# Altium schematic sheet connectors.SchDoc
size 431 x 279 mm; SheetNumber: 2; SheetTotal: 4
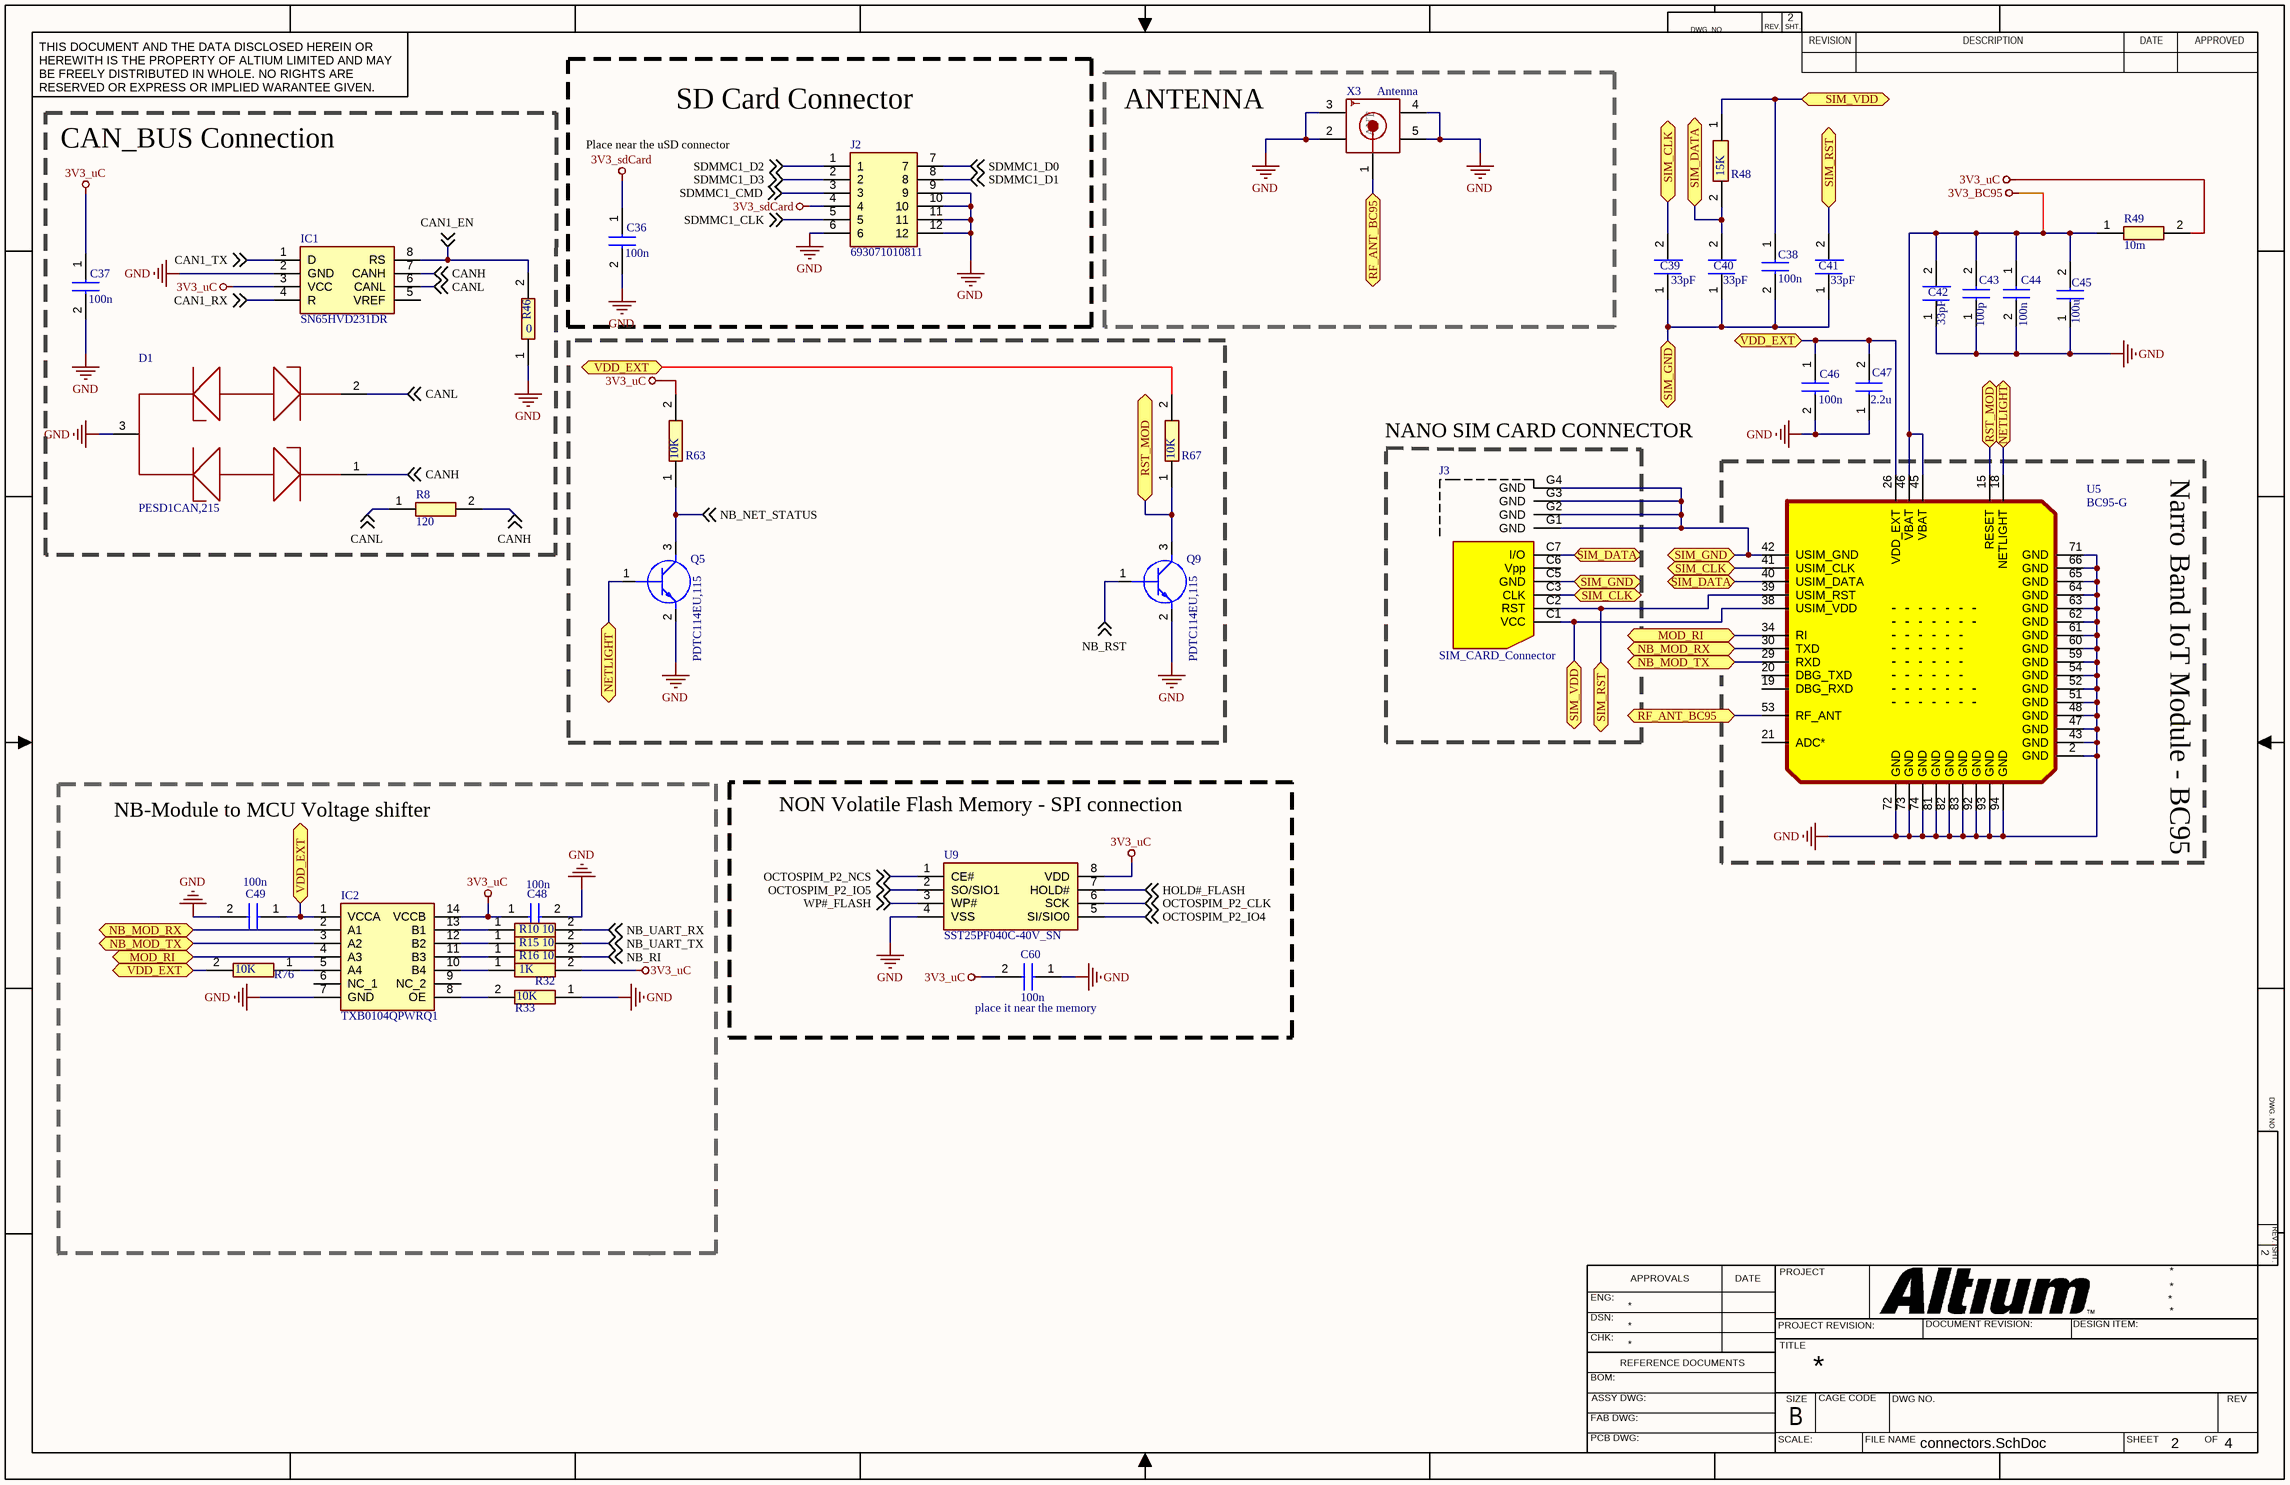
[diagram p0: connectors.SchDoc]

## Parts
C36  100n  [CAPC1608X87N]
C37  100n  [CAPC1608X87N]
C38  100n  [CAPC1608X87N]
C39  33pF  [CAPC1608X87N]
C40  33pF  [CAPC1608X87N]
C41  33pF  [CAPC1608X87N]
C42  33pF  [CAPC1608X87N]
C43  100p  [CAPC1608X87N]
C44  100n  [CAPC1608X87N]
C45  100u  [CAPC3216X180N]
C46  100n  [CAPC1608X87N]
C47  2.2u  [CAPC1608X50N]
C48  100n  [CAPC1608X87N]
C49  100n  [CAPC1608X87N]
C60  100n  [CAPC1608X87N]
D1  PESD1CAN,215  [SOT95P230X110-3N]
IC1  SN65HVD231DR  [SOIC127P600X175-8N]
IC2  TXB0104QPWRQ1  [SOP65P640X120-14N]
J2  693071010811  [693071010811]
J3  SIM_CARD_Connector  [SIM8060601400A]
Q5  PDTC114EU,115  [SOT65P210X110-3N]
Q9  PDTC114EU,115  [SOT65P210X110-3N]
R8  120  [ERA2V_(0402)]
R10  10  [RESC1005X40N]
R15  10  [RESC1005X40N]
R16  10  [RESC1005X40N]
R32  1K  [RESC1608X55N]
R33  10K  [ERJ3EK_(0603)]
R46  0  [RESC1608X55N]
R48  15K  [RESC1508X50N]
R49  10m  [ERJ6_B_BW_R_LW_CW_D]
R63  10K  [ERJ3EK_(0603)]
R67  10K  [ERJ3EK_(0603)]
R76  10K  [ERJ3EK_(0603)]
U5  BC95-G  [XCVR_BC95GJB02STD]
U9  SST25PF040C-40V_SN  [SOIC127P600X175-8N]
X3  Antenna  [PCBSMAFRAHT]

## Blocks framed on the sheet
CAN_BUS Connection: C37 D1 IC1 R8 R46
SD Card Connector: C36 J2
ANTENNA: X3
NB-Module to MCU Voltage shifter: C48 C49 IC2 R10 R15 R16 R32 R33 R76
NON Volatile Flash Memory - SPI connection: C60 U9

## Ports
MOD_RI (bidir), NB_MOD_RX (bidir), NB_MOD_TX (bidir), NETLIGHT (bidir), RF_ANT_BC95 (bidir), RST_MOD (bidir), SIM_CLK (bidir), SIM_DATA (bidir), SIM_GND (bidir), SIM_RST (bidir), SIM_VDD (bidir), VDD_EXT (bidir)

## Nets
3V3_BC95: C42.2 C43.2 C44.1 C45.2 R49.1 U5.45(VBAT) U5.46(VBAT)
3V3_sdCard: C36.1 J2.4
3V3_uC: C37.1 C48.1 C60.2 IC1.3(VCC) IC2.14(VCCB) R32.2 R49.2 R63.2 U9.8(VDD)
GND: C36.2 C37.2 C42.1 C43.1 C44.2 C45.1 C46.2 C47.1 C48.2 C49.2 C60.1 D1.3 IC1.2(GND) IC2.7(GND) J2.6 J2.9 J2.10 J2.11 J2.12 Q5.2(E) Q9.2(E) R33.1 R46.1 U5.2(GND) U5.43(GND) U5.47(GND) U5.48(GND) U5.51(GND) U5.52(GND) U5.54(GND) U5.59(GND) U5.60(GND) U5.61(GND) U5.62(GND) U5.63(GND) U5.64(GND) U5.65(GND) U5.66(GND) U5.71(GND) U5.72(GND) U5.73(GND) U5.74(GND) U5.81(GND) U5.82(GND) U5.83(GND) U5.92(GND) U5.93(GND) U5.94(GND) U9.4(VSS) X3.2 X3.3 X3.4 X3.5
CAN1_EN: IC1.8(RS) R46.2 ; off-sheet CAN1_EN
CAN1_RX: IC1.4(R) ; off-sheet CAN1_RX
CAN1_TX: IC1.1(D) ; off-sheet CAN1_TX
CANH: D1.1 IC1.7(CANH) R8.2 ; off-sheet CANH
CANL: D1.2 IC1.6(CANL) R8.1 ; off-sheet CANL
HOLD#_FLASH: U9.7(HOLD#) ; off-sheet HOLD#_FLASH
MOD_RI: IC2.4(A3) U5.34(RI) ; port MOD_RI
NB_MOD_RX: IC2.2(A1) U5.30(TXD) ; port NB_MOD_RX
NB_MOD_TX: IC2.3(A2) U5.29(RXD) ; port NB_MOD_TX
NB_NET_STATUS: Q5.3(C) R63.1 ; off-sheet NB_NET_STATUS
NB_RI: R16.2 ; off-sheet NB_RI
NB_RST: Q9.1(B) ; off-sheet NB_RST
NB_UART_RX: R10.2 ; off-sheet NB_UART_RX
NB_UART_TX: R15.2 ; off-sheet NB_UART_TX
NETLIGHT: Q5.1(B) U5.18(NETLIGHT) ; port NETLIGHT
OCTOSPIM_P2_CLK: U9.6(SCK) ; off-sheet OCTOSPIM_P2_CLK
OCTOSPIM_P2_IO4: U9.5(SI/SIO0) ; off-sheet OCTOSPIM_P2_IO4
OCTOSPIM_P2_IO5: U9.2(SO/SIO1) ; off-sheet OCTOSPIM_P2_IO5
OCTOSPIM_P2_NCS: U9.1(CE#) ; off-sheet OCTOSPIM_P2_NCS
RF_ANT_BC95: U5.53(RF_ANT) X3.1 ; port RF_ANT_BC95
RST_MOD: Q9.3(C) R67.1 U5.15(RESET) ; port RST_MOD
SDMMC1_CLK: J2.5 ; off-sheet SDMMC1_CLK
SDMMC1_CMD: J2.3 ; off-sheet SDMMC1_CMD
SDMMC1_D0: J2.7 ; off-sheet SDMMC1_D0
SDMMC1_D1: J2.8 ; off-sheet SDMMC1_D1
SDMMC1_D2: J2.1 ; off-sheet SDMMC1_D2
SDMMC1_D3: J2.2 ; off-sheet SDMMC1_D3
SIM_CLK: C39.2 J3.C3(CLK) U5.41(USIM_CLK) ; port SIM_CLK
SIM_DATA: C40.2 J3.C7(I/O) R48.2 U5.40(USIM_DATA) ; port SIM_DATA
SIM_GND: C38.2 C39.1 C40.1 C41.1 J3.C5(GND) J3.G1(GND) J3.G2(GND) J3.G3(GND) J3.G4(GND) U5.42(USIM_GND) ; port SIM_GND
SIM_RST: C41.2 J3.C2(RST) U5.39(USIM_RST) ; port SIM_RST
SIM_VDD: C38.1 J3.C1(VCC) R48.1 U5.38(USIM_VDD) ; port SIM_VDD
VDD_EXT: C46.1 C47.2 C49.1 IC2.1(VCCA) R67.2 R76.2 U5.26(VDD_EXT) ; port VDD_EXT
WP#_FLASH: U9.3(WP#) ; off-sheet WP#_FLASH
NetIC2_5: IC2.5(A4) R76.1
NetIC2_8: IC2.8(OE) R33.2
NetIC2_10: IC2.10(B4) R32.1
NetIC2_11: IC2.11(B3) R16.1
NetIC2_12: IC2.12(B2) R15.1
NetIC2_13: IC2.13(B1) R10.1

Not connected (* = marked no-connect by the designer): IC1 5(VREF); IC2 6(NC_1) 9(NC_2); J3 C6(Vpp); U5 1(RESERVED) 3(RESERVED) 4(RESERVED) 5(RESERVED) 6(RESERVED) 7(RESERVED) 8(RESERVED) 9(RESERVED) 10(RESERVED) 11(RESERVED) 12(RESERVED) 13(RESERVED) 14(RESERVED) 16(RESERVED) 17(RESERVED) 19(DBG_RXD) 20(DBG_TXD) 21(ADC*) 22(RESERVED) 23(RESERVED) 24(RESERVED) 25(RESERVED) 27(RESERVED) 28(RESERVED) 31(RESERVED) 32(RESERVED) 33(RESERVED) 35(RESERVED) 36(RESERVED) 37(RESERVED) 44(RESERVED) 49(RESERVED) 50(RESERVED) 55(RESERVED) 56(RESERVED) 57(RESERVED) 58(RESERVED) 67(RESERVED) 68(RESERVED) 69(RESERVED) 70(RESERVED) 75(RESERVED) 76(RESERVED) 77(RESERVED) 78(RESERVED) 79(RESERVED) 80(RESERVED) 84(RESERVED) 85(RESERVED) 86(RESERVED) 87(RESERVED) 88(RESERVED) 89(RESERVED) 90(RESERVED) 91(RESERVED)

## Notes on the sheet
- Place near the uSD connector
- (near J3) NANO SIM CARD CONNECTOR
- Narro Band IoT Module - BC95
- (near C60) place it near the memory
- DWG. NO.
- REV.
- SHT.
- THIS DOCUMENT AND THE DATA DISCLOSED HEREIN OR HEREWITH IS THE PROPERTY OF ALTIUM LIMITED AND MAY BE FREELY DISTRIBUTED IN WHOLE. NO RIGHTS ARE RESERVED OR EXPRESS OR IMPLIED WARANTEE GIVEN.
- REVISION
- DESCRIPTION
- DATE
- APPROVED
- ENG:
- APPROVALS
- PROJECT
- DSN:
- CHK:
- REFERENCE DOCUMENTS
- PROJECT REVISION:
- TITLE
- DOCUMENT REVISION:
- DESIGN ITEM:
- BOM:
- FAB DWG:
- PCB DWG:
- ASSY DWG:
- SCALE:
- SIZE
- B
- CAGE CODE
- FILE NAME
- DWG NO.
- SHEET
- OF
- REV
- (in symbol PCB.SMAFRA.HT) ANT

## Library data of the parts
C36-C38 C44 C46 C48 C49 C60 = 885012206071: Capacitor; Manufacturer_Name: Wurth Elektronik; Datasheet Link: https://katalog.we-online.com/pbs/datasheet/885012206071.pdf; Height: 0.87mm; Manufacturer_Part_Number: 885012206071
C39-C42 = VJ0603A330KXXCW1BC: Cap Ceramic 33pF 25V C0G 10% SMD 0603 125°C Paper T/R; Manufacturer: Vishay Vitramon; Dielectric Material: Tantalum; Supplier 1: Mouser; Supplier Part Number 1: 77-VJ0603A330KXXCBC; Manufacturer Part Number: VJ0603A330KXXCW1BC; RoHS: Yes; Category: Ceramic Capacitors; Stock 1: 1121; Mount: Surface Mount; Case/Package: 0603; Case Code (Imperial): 0603; Case Code (Metric): 1608; Min Operating Temperature: -55°C; Max Operating Temperature: 125°C; Capacitance: 33pF; Tolerance: 10%; Package Quantity: 4000; Packaging: Tape and Reel; Dielectric: C0G; Voltage Rating (DC): 25V; Termination: SMD/SMT; Series: VJ W1BC; Construction: Flat; Length: 1.6mm; Width: 0.8mm; Height: 0.95mm; Depth: 0.8mm; Lead Free: Lead Free; RoHS Compliant: Yes; ComponentLink1URL: http://www.mouser.com/ds/2/427/vjw1bcbascomseries-223529.pdf?src-supplier=Mouser; ComponentLink1Description: http://www.mouser.com/ds/2/427/vjw1bcbascomseries-223529.pdf?src-supplier=Mouser; ComponentLink2URL: http://www.vishay.com/docs/28548/vjw1bcbascomseries.pdf?src-supplier=Avnet; ComponentLink2Description: http://www.vishay.com/docs/28548/vjw1bcbascomseries.pdf?src-supplier=Avnet; ComponentLink3URL: https://www.vishay.com/docs/28548/vjw1bcbascomseries.pdf?src-supplier=Digi-Key; ComponentLink3Description: https://www.vishay.com/docs/28548/vjw1bcbascomseries.pdf?src-supplier=Digi-Key
C43 = 885012206003: Capacitor; Manufacturer_Name: Wurth Elektronik; Datasheet Link: https://katalog.we-online.com/pbs/datasheet/885012206003.pdf; Height: 0.87mm; Manufacturer_Part_Number: 885012206003
C45 = GRM31CR60J107ME39L: Capacitor; Manufacturer_Name: Murata Electronics; Datasheet Link: https://componentsearchengine.com//GRM31CR60J107ME39L.pdf; Height: 1.8mm; Mouser2 Part Number: 81-GRM31CR60J107ME9L; Mouser2 Price/Stock: https://www.mouser.com/Search/Refine.aspx?Keyword=81-GRM31CR60J107ME9L; Manufacturer_Part_Number: GRM31CR60J107ME39L
C47 = EMK107BJ225KA-T: Capacitor; Manufacturer_Name: TAIYO YUDEN; Height: 0.5mm; Manufacturer_Part_Number: EMK107BJ225KA-T
D1 = PESD1CAN,215: ESD Suppressor Diode TVS Bi-Dir 24V Automotive 3-Pin SOT-23 T/R / TVS DIODE 24VWM 70VC SOT23; Manufacturer: Nexperia; Supplier 1: RSComponents; Supplier Part Number 1: 1242373; Manufacturer Part Number: PESD1CAN,215; RoHS: Yes; Category: ESD and Circuit Protection ICs; Stock 1: 129000; ComponentLink1URL: http://www.farnell.com/datasheets/109497.pdf?src-supplier=Farnell; ComponentLink1Description: http://www.farnell.com/datasheets/109497.pdf?src-supplier=Farnell; ComponentLink2URL: https://assets.nexperia.com/documents/data-sheet/PESD1CAN.pdf?src-supplier=Digi-Key; ComponentLink2Description: https://assets.nexperia.com/documents/data-sheet/PESD1CAN.pdf?src-supplier=Digi-Key; ComponentLink3URL: http://www.farnell.com/datasheets/109497.pdf?src-supplier=Newark; ComponentLink3Description: http://www.farnell.com/datasheets/109497.pdf?src-supplier=Newark
IC1 = SN65HVD231DR: Integrated Circuit; Manufacturer_Name: Texas Instruments; Datasheet Link: http://www.ti.com/lit/gpn/sn65hvd231; Height: 1.75mm; Manufacturer_Part_Number: SN65HVD231DR
IC2 = TXB0104QPWRQ1: Integrated Circuit; Manufacturer_Name: Texas Instruments; Datasheet Link: http://www.ti.com/lit/gpn/txb0104-q1; Height: 1.2mm; Mouser2 Part Number: 595-TXB0104QPWRQ1; Mouser2 Price/Stock: https://www.mouser.com/Search/Refine.aspx?Keyword=595-TXB0104QPWRQ1; Manufacturer_Part_Number: TXB0104QPWRQ1
J2 = 693071010811: Connector; Manufacturer_Name: Wurth Elektronik; Datasheet Link: https://www.we-online.de/katalog/datasheet/693071010811.pdf; Height: 2.13mm; Manufacturer_Part_Number: 693071010811
J3 = SIM8060-6-0-14-00-A: Sim Nano Hinged, 6P, 1.40MM Prof; Manufacturer: GCT; Supplier 1: Digi-Key; Supplier Part Number 1: 2073-SIM8060-6-0-14-00-ACT-ND; Manufacturer Part Number: SIM8060-6-0-14-00-A
Q5 Q9 = PDTC114EU,115: Transistor BJT NPN; Manufacturer_Name: Nexperia; Datasheet Link: https://componentsearchengine.com//PDTC114EU,115.pdf; Height: 1.1mm; Mouser2 Part Number: 771-PDTC114EU115; Mouser2 Price/Stock: https://www.mouser.com/Search/Refine.aspx?Keyword=771-PDTC114EU115; Manufacturer_Part_Number: PDTC114EU,115
R8 = ERA-2VEB1200X: Resistor; Manufacturer_Name: Panasonic; Datasheet Link: http://industrial.panasonic.com/cdbs/www-data/pdf/RDM0000/RDM0000C331.pdf; Height: 0.4mm; Manufacturer_Part_Number: ERA-2VEB1200X
R10 R15 R16 = CR0402-FX-10R0GLF: Resistor; Manufacturer_Name: Bourns; Datasheet Link: https://www.bourns.com/pdfs/CR0402.pdf; Height: 0.4mm; Manufacturer_Part_Number: CR0402-FX-10R0GLF
R32 = CRCW06031K00FKEAC: Resistor; Manufacturer_Name: Vishay; Datasheet Link: https://componentsearchengine.com//CRCW06031K00FKEAC.pdf; Height: 0.55mm; Mouser2 Part Number: 71-CRCW06031K00FKEAC; Mouser2 Price/Stock: https://www.mouser.com/Search/Refine.aspx?Keyword=71-CRCW06031K00FKEAC; Manufacturer_Part_Number: CRCW06031K00FKEAC
R33 R63 R67 R76 = ERJ-3EKF1002V: Resistor; Manufacturer_Name: Panasonic; Datasheet Link: https://componentsearchengine.com//ERJ-3EKF1002V.pdf; Height: 0.55mm; Mouser2 Part Number: 667-ERJ-3EKF1002V; Mouser2 Price/Stock: https://www.mouser.com/Search/Refine.aspx?Keyword=667-ERJ-3EKF1002V; Manufacturer_Part_Number: ERJ-3EKF1002V
R46 = RC0603FR-070RL: Resistor; Manufacturer_Name: YAGEO (PHYCOMP); Height: 0.55mm; Manufacturer_Part_Number: RC0603FR-070RL
R48 = RCS060315K0FKEA: Res Thick Film 0603 15K Ohm 1% 0.25W(1/4W) ±100ppm/°C Pad SMD Automotive Medical T/R; Manufacturer: Vishay Dale; Max Power Dissipation: 250mW; Resistance: 15kR; Supplier 1: Digi-Key; Supplier Part Number 1: 541-2796-1-ND; Manufacturer Part Number: RCS060315K0FKEA; RoHS: Yes; Category: Chip SMD Resistors; Stock 1: 3973; Case/Package: 0603; Case Code (Imperial): 0603; Case Code (Metric): 1608; Min Operating Temperature: -55°C; Max Operating Temperature: 155°C; Tolerance: 1%; Temperature Coefficient: 100ppm/°C; Packaging: Tape and Reel; Resistor Type: Thick Film; Number of Terminations: 2; Features: Automotive AEC-Q200; Length: 0.061inch; Width: 0.033inch; Height: 0.02inch; ComponentLink1URL: http://www.vishay.com/docs/20065/rcse3.pdf?src-supplier=Digi-Key; ComponentLink1Description: http://www.vishay.com/docs/20065/rcse3.pdf?src-supplier=Digi-Key
R49 = ERJ-6CWDR010V: Resistor; Manufacturer_Name: Panasonic; Datasheet Link: https://componentsearchengine.com//ERJ-6CWDR010V.pdf; Mouser2 Part Number: 667-ERJ-6CWDR010V; Mouser2 Price/Stock: https://www.mouser.com/Search/Refine.aspx?Keyword=667-ERJ-6CWDR010V; Manufacturer_Part_Number: ERJ-6CWDR010V
U5 = MIKROE-3294: NB IoT Click BC95 LTE CAT NB1 Module Add-On Board; Manufacturer: mikroElektronika; Supplier 1: RSComponents; Supplier Part Number 1: 1840145; Manufacturer Part Number: MIKROE-3294; RoHS: No; Stock 1: 1
U9 = SST25PF040C-40V_SN: Integrated Circuit; Manufacturer_Name: Microchip; Manufacturer_Part_Number: SST25PF040C-40V/SN; Datasheet Link: https://componentsearchengine.com/Datasheets/1/SST25PF040C-40V_SN.pdf; Height: 1.75mm
X3 = PCB.SMAFRA.HT: CONNSMAJACKR/A50OHMPCB; Manufacturer: Taoglas; Body Material: Brass; Dielectric Material: PTFE; Body Plating: Gold; Connector Type: SMA,Socket; Max Frequency: 6GHz; Voltage Rating: 500V; Impedance: 50R; Supplier 1: Digi-Key; Supplier Part Number 1: 931-1361-ND; Manufacturer Part Number: PCB.SMAFRA.HT; RoHS: Yes; Category: RF / Coaxial Connectors; Stock 1: 9426; Mount: Through Hole,Surface Mount; Case/Package: SMA; Contact Plating: Gold; Contact Material: Brass; Housing Color: Gold; Package Quantity: 500; Packaging: Tray; Termination: Solder; Fastening Type: Threaded; Frequency: 6GHz; Orientation: Right Angle; ComponentLink1URL: http://taoglas.com/images/product_images/original_images/PCB.SMAFRA.HT.pdf?src-supplier=Avnet; ComponentLink1Description: http://taoglas.com/images/product_images/original_images/PCB.SMAFRA.HT.pdf?src-supplier=Avnet; ComponentLink2URL: http://www.taoglas.com/wp-content/uploads/2016/01/PCB.SMAFRA.HT_.pdf?src-supplier=Digi-Key; ComponentLink2Description: http://www.taoglas.com/wp-content/uploads/2016/01/PCB.SMAFRA.HT_.pdf?src-supplier=Digi-Key